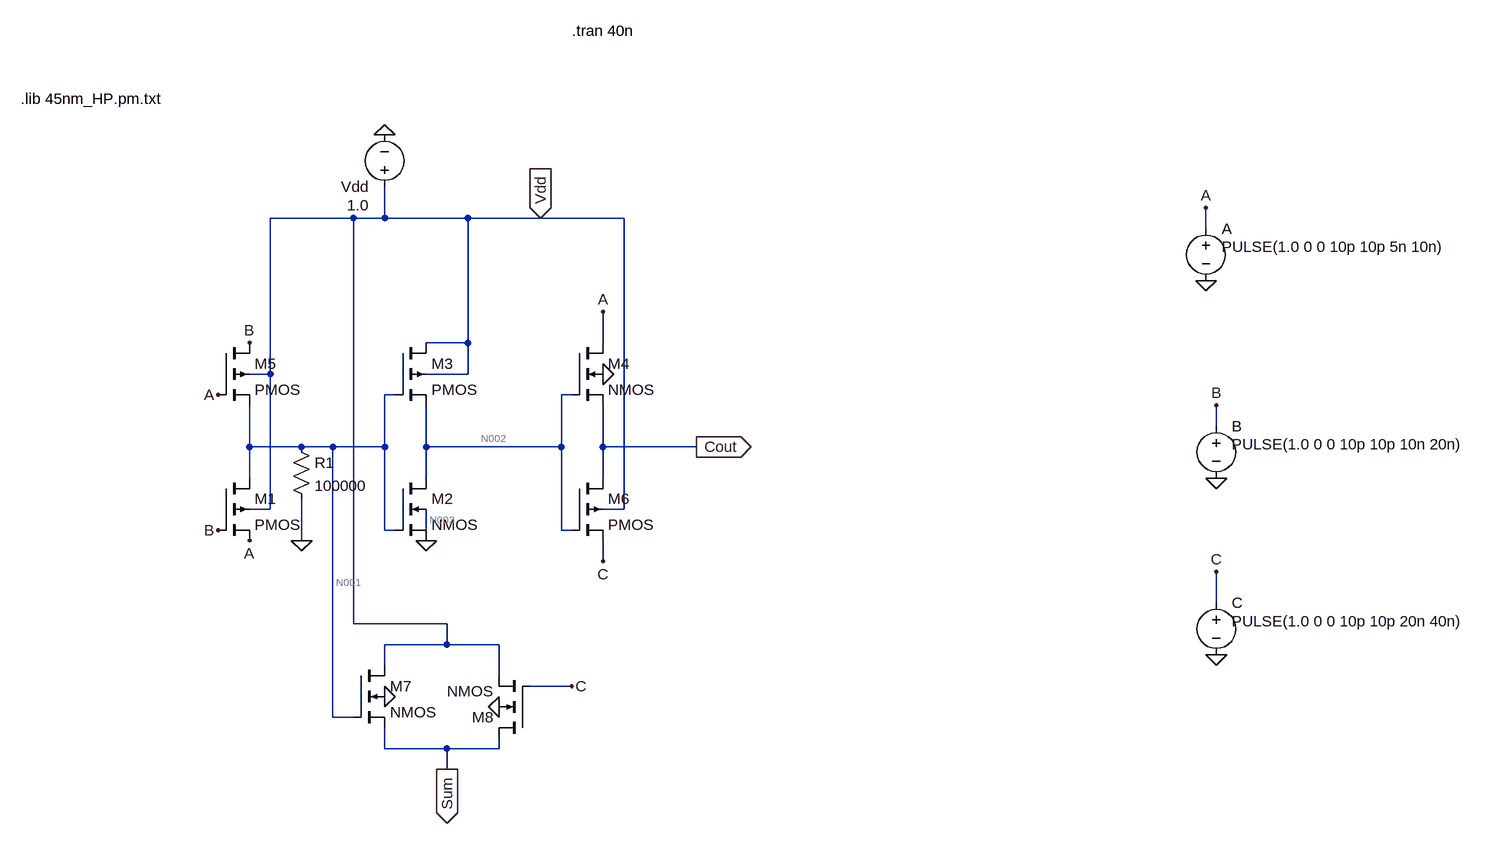
[diagram p0: schematic InXA2_45nm.asc]
InXA2_45nm.asc, the LTspice schematic file:
Version 4
SHEET 1 1044 720
WIRE -688 -240 -816 -240
WIRE -640 -240 -640 -288
WIRE -640 -240 -688 -240
WIRE -512 -240 -640 -240
WIRE -400 -240 -512 -240
WIRE -272 -240 -400 -240
WIRE 624 -224 624 -256
WIRE -512 -48 -512 -240
WIRE -512 -48 -576 -48
WIRE -304 -48 -304 -96
WIRE -816 0 -816 -240
WIRE -816 0 -848 0
WIRE -512 0 -512 -48
WIRE -512 0 -576 0
WIRE -624 32 -640 32
WIRE -352 32 -368 32
WIRE 640 80 640 48
WIRE -848 112 -848 48
WIRE -768 112 -848 112
WIRE -720 112 -768 112
WIRE -640 112 -640 32
WIRE -640 112 -720 112
WIRE -576 112 -576 48
WIRE -368 112 -368 32
WIRE -368 112 -576 112
WIRE -304 112 -304 48
WIRE -160 112 -304 112
WIRE -848 160 -848 112
WIRE -576 160 -576 112
WIRE -304 160 -304 112
WIRE -816 208 -816 0
WIRE -816 208 -848 208
WIRE -272 208 -272 -240
WIRE -272 208 -304 208
WIRE -640 240 -640 112
WIRE -624 240 -640 240
WIRE -576 240 -576 208
WIRE -368 240 -368 112
WIRE -352 240 -368 240
WIRE -768 256 -768 192
WIRE -304 288 -304 256
WIRE 640 352 640 304
WIRE -688 384 -688 -240
WIRE -544 384 -688 384
WIRE -544 416 -544 384
WIRE -544 416 -640 416
WIRE -464 416 -544 416
WIRE -640 448 -640 416
WIRE -464 464 -464 416
WIRE -352 480 -416 480
WIRE -720 528 -720 112
WIRE -688 528 -720 528
WIRE -640 576 -640 544
WIRE -544 576 -640 576
WIRE -464 576 -464 560
WIRE -464 576 -544 576
WIRE -544 608 -544 576
FLAG 624 -144 0
FLAG 640 160 0
FLAG 640 432 0
FLAG 624 -256 A
FLAG 640 48 B
FLAG 640 304 C
FLAG -400 -240 Vdd
IOPIN -400 -240 In
FLAG -640 -368 0
FLAG -896 32 A
FLAG -848 256 A
FLAG -896 240 B
FLAG -848 -48 B
FLAG -576 256 0
FLAG -304 0 0
FLAG -304 -96 A
FLAG -304 288 C
FLAG -160 112 Cout
IOPIN -160 112 Out
FLAG -640 496 0
FLAG -464 512 0
FLAG -768 256 0
FLAG -544 608 Sum
IOPIN -544 608 Out
FLAG -352 480 C
SYMBOL voltage 624 -240 R0
WINDOW 3 24 44 Left 2
WINDOW 123 0 0 Left 0
WINDOW 39 0 0 Left 0
SYMATTR Value PULSE(1.0 0 0 10p 10p 5n 10n)
SYMATTR InstName A
SYMBOL voltage 640 64 R0
WINDOW 3 24 44 Left 2
WINDOW 123 0 0 Left 0
WINDOW 39 0 0 Left 0
SYMATTR Value PULSE(1.0 0 0 10p 10p 10n 20n)
SYMATTR InstName B
SYMBOL voltage 640 336 R0
WINDOW 3 24 44 Left 2
WINDOW 123 0 0 Left 0
WINDOW 39 0 0 Left 0
SYMATTR Value PULSE(1.0 0 0 10p 10p 20n 40n)
SYMATTR InstName C
SYMBOL voltage -640 -272 R180
WINDOW 3 24 -12 Left 2
WINDOW 123 0 0 Left 0
WINDOW 39 0 0 Left 0
SYMATTR Value 1.0
SYMATTR InstName Vdd
SYMBOL nmos4 -352 -48 R0
SYMATTR InstName M4
SYMATTR Value2 l=45n w=90n
SYMBOL pmos4 -896 -48 R0
SYMATTR InstName M5
SYMATTR Value2 l=45n w=180n
SYMBOL res -784 96 R0
SYMATTR InstName R1
SYMATTR Value 100000
SYMBOL pmos4 -896 160 R0
SYMATTR InstName M1
SYMATTR Value2 l=45n w=180n
SYMBOL pmos4 -624 -48 R0
SYMATTR InstName M3
SYMATTR Value2 l=45n w=180n
SYMBOL pmos4 -352 160 R0
SYMATTR InstName M6
SYMATTR Value2 l=45n w=180n
SYMBOL nmos4 -624 160 R0
SYMATTR InstName M2
SYMATTR Value2 l=45n w=90n
SYMBOL nmos4 -688 448 R0
SYMATTR InstName M7
SYMATTR Value2 l=45n w=90n
SYMBOL nmos4 -416 560 R180
SYMATTR InstName M8
SYMATTR Value2 l=45n w=90n
TEXT -1200 -424 Left 2 !.lib 45nm_HP.pm.txt
TEXT -352 -528 Left 2 !.tran 40n

The netlist it stands for:
* InXA2_45nm.asc
V§A A 0 PULSE(1.0 0 0 10p 10p 5n 10n)
V§B B 0 PULSE(1.0 0 0 10p 10p 10n 20n)
V§C C 0 PULSE(1.0 0 0 10p 10p 20n 40n)
Vdd Vdd 0 1.0
M4 A N002 Cout 0 NMOS l=45n w=90n
M5 B A N001 Vdd PMOS l=45n w=180n
R1 N001 0 100000
M1 N001 B A Vdd PMOS l=45n w=180n
M3 Vdd N001 N002 Vdd PMOS l=45n w=180n
M6 Cout N002 C Vdd PMOS l=45n w=180n
M2 N002 N001 0 N003 NMOS l=45n w=90n
M7 Vdd N001 Sum 0 NMOS l=45n w=90n
M8 Sum C Vdd 0 NMOS l=45n w=90n
.model NMOS NMOS
.model PMOS PMOS
.lib standard.mos
.lib 45nm_HP.pm.txt
.tran 40n
.backanno
.end

* Results of the author's LTspice run, read from the files saved beside the schematic
* Operating Point, zero values left out:
*   V(a) = 1 V
*   V(b) = 1 V
*   V(c) = 1 V
*   V(vdd) = 1 V
*   V(n002) = 1 V
*   V(cout) = 995.5 mV
*   V(n001) = 208.1 µV
*   V(n003) = 260.1 mV
*   V(sum) = 878.3 mV
*   Id(M3) = 10.79 nA
*   Ig(M3) = -255.9 pA
*   Ib(M3) = 5.289 pA
*   Is(M3) = -10.54 nA
*   Id(M1) = -895.9 pA
*   Ig(M1) = 124.7 pA
*   Ib(M1) = 1.01 pA
*   Is(M1) = 770.2 pA
*   Id(M5) = 770.2 pA
*   Ig(M5) = 124.7 pA
*   Is(M5) = -895.9 pA
*   Id(M8) = -8.476 pA
*   Ib(M8) = -1.891 pA
*   Is(M8) = 10.36 pA
*   Id(M7) = 13.8 pA
*   Ig(M7) = -20.39 pA
*   Ib(M7) = -1.888 pA
*   Is(M7) = 8.476 pA
*   Id(M2) = 10.54 nA
*   Ig(M2) = -12.79 pA
*   Is(M2) = -10.53 nA
*   Id(M4) = 1.026 pA
*   Ib(M4) = -2.008 pA
*   I(R1) = 2.081 nA
*   I(Vdd) = -10.83 nA
*   I(B) = -894.9 pA
*   I(A) = -895.9 pA
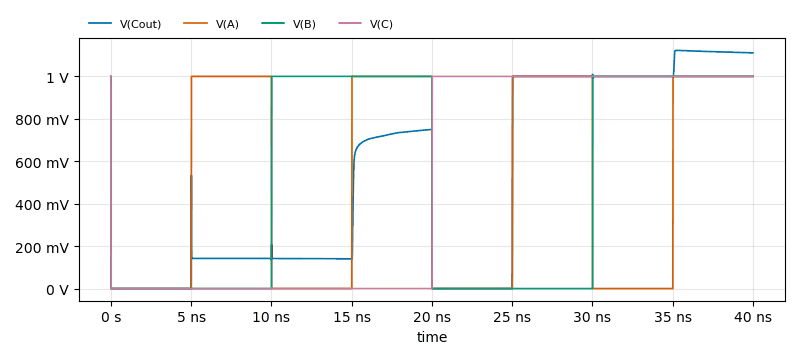
[diagram p1: Transient Analysis of InXA2_45nm.asc, plotted from the saved traces]
* Transient Analysis, 1 run:
*   V(Cout): min -1.119 mV, max 1.123 V, average 513.3 mV, rms 688.3 mV, last 1.111 V
*   V(A): min 0 V, max 1 V, average 499 mV, rms 706.2 mV, last 1 V
*   V(B): min 0 V, max 1 V, average 499.5 mV, rms 706.6 mV, last 1 V
*   V(C): min 0 V, max 1 V, average 499.7 mV, rms 706.9 mV, last 1 V